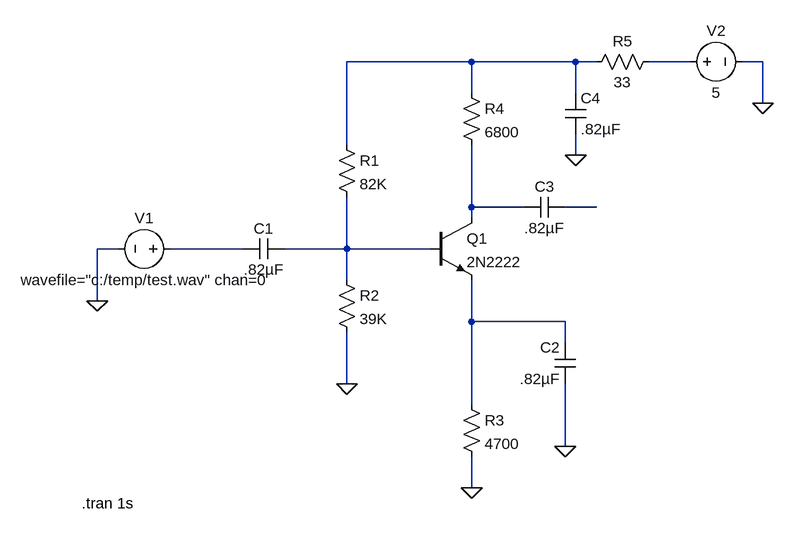
[diagram p0: schematic class_a_amplifier_wav.asc]
class_a_amplifier_wav.asc, the LTspice schematic file:
Version 4
SHEET 1 924 680
WIRE 32 -64 -160 -64
WIRE 192 -64 32 -64
WIRE 224 -64 192 -64
WIRE 368 -64 304 -64
WIRE 480 -64 448 -64
WIRE 32 -16 32 -64
WIRE 192 -16 192 -64
WIRE 480 0 480 -64
WIRE -160 64 -160 -64
WIRE 192 80 192 48
WIRE 32 160 32 64
WIRE 112 160 32 160
WIRE 224 160 176 160
WIRE 32 176 32 160
WIRE -512 224 -544 224
WIRE -320 224 -432 224
WIRE -160 224 -160 144
WIRE -160 224 -256 224
WIRE -32 224 -160 224
WIRE -160 272 -160 224
WIRE -544 304 -544 224
WIRE 32 336 32 272
WIRE 176 336 32 336
WIRE 176 368 176 336
WIRE -160 432 -160 352
WIRE 32 464 32 336
WIRE 176 528 176 432
WIRE 32 592 32 544
FLAG 480 0 0
FLAG 192 80 0
FLAG 176 528 0
FLAG 32 592 0
FLAG -160 432 0
FLAG -544 304 0
SYMBOL voltage -416 224 R90
WINDOW 0 -32 56 VBottom 2
WINDOW 3 32 56 VTop 2
WINDOW 123 60 56 VTop 2
WINDOW 39 0 0 Left 2
SYMATTR InstName V1
SYMATTR Value wavefile="c:/temp/test.wav" chan=0
SYMBOL voltage 352 -64 R270
WINDOW 0 32 56 VTop 2
WINDOW 3 -32 56 VBottom 2
WINDOW 123 0 0 Left 2
WINDOW 39 0 0 Left 2
SYMATTR InstName V2
SYMATTR Value 5
SYMBOL cap -256 208 R90
WINDOW 0 0 32 VBottom 2
WINDOW 3 32 32 VTop 2
SYMATTR InstName C1
SYMATTR Value .82µF
SYMBOL res -176 48 R0
SYMATTR InstName R1
SYMATTR Value 82K
SYMBOL res -176 256 R0
SYMATTR InstName R2
SYMATTR Value 39K
SYMBOL res 16 -32 R0
SYMATTR InstName R4
SYMATTR Value 6800
SYMBOL res 16 448 R0
SYMATTR InstName R3
SYMATTR Value 4700
SYMBOL res 320 -80 R90
WINDOW 0 0 56 VBottom 2
WINDOW 3 32 56 VTop 2
SYMATTR InstName R5
SYMATTR Value 33
SYMBOL cap 192 432 R180
WINDOW 0 24 56 Left 2
WINDOW 3 24 8 Left 2
SYMATTR InstName C2
SYMATTR Value .82µF
SYMBOL cap 112 176 R270
WINDOW 0 32 32 VTop 2
WINDOW 3 0 32 VBottom 2
SYMATTR InstName C3
SYMATTR Value .82µF
SYMBOL cap 176 -16 R0
SYMATTR InstName C4
SYMATTR Value .82µF
SYMBOL npn -32 176 R0
SYMATTR InstName Q1
SYMATTR Value 2N2222
TEXT -568 616 Left 2 !.tran 1s

The netlist it stands for:
* class_a_amplifier_wav.asc
V1 N005 0 wavefile="c:/temp/test.wav" chan=0
V2 N002 0 5
C1 N006 N005 .82µF
R1 N001 N006 82K
R2 N006 0 39K
R4 N001 N003 6800
R3 N007 0 4700
R5 N002 N001 33
C2 0 N007 .82µF
C3 N003 N004 .82µF
C4 N001 0 .82µF
Q1 N003 N006 N007 0 2N2222
.model NPN NPN
.model PNP PNP
.lib standard.bjt
.tran 1s
.backanno
.end